# Altium schematic sheet Linear_Pos_regulator.SchDoc: FPGA Motherboard for Digital Multiplexed Readout, McGill U.
size A; DocumentNumber: DfMUX23; Revision: Rev0, Prototype; SheetNumber: 23; SheetTotal: 27; PageSetup: Record=PageOptions|CenterHorizontal=True|CenterVertical=True|PrintScale=1.05|XCorrection=1.00|YCorrection=1.00|PrintKind=0|BorderSize=5000000|LeftOffset=0|BottomOffset=0|Orientation=2|PaperLength=1000|PaperWidth=1000|Scale=100|PaperSource=7|PrintQuality=-4|MediaType=1|DitherType=10|PaperKind=Letter|PrintScaleMode=1
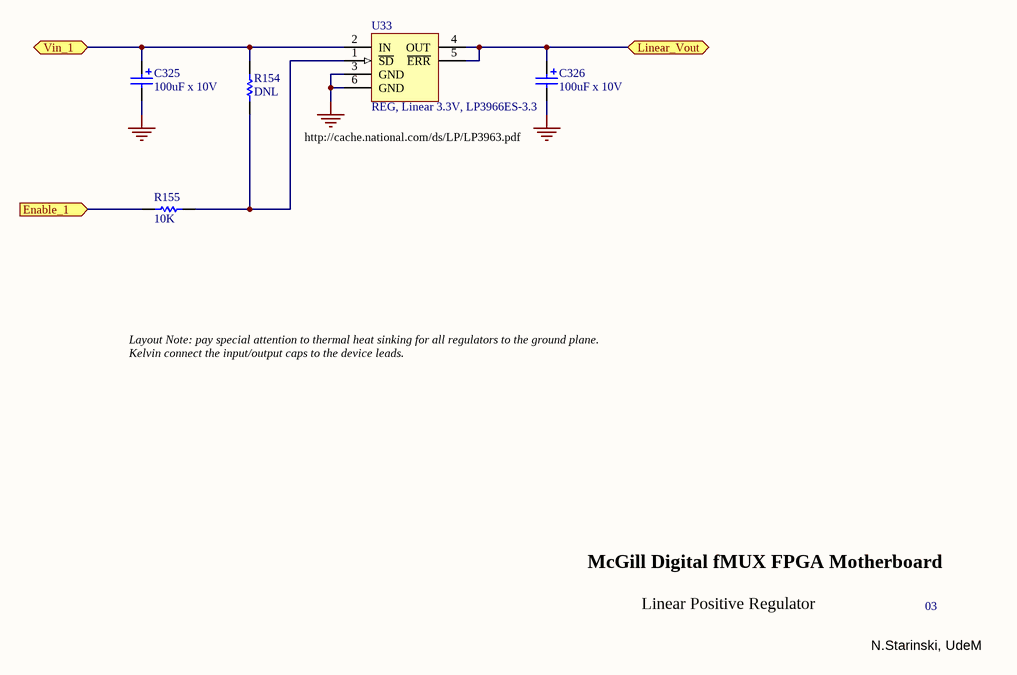
[diagram p0: Linear_Pos_regulator.SchDoc]

## Parts
C325  100uF x 10V  [TC6032-2412]
C326  100uF x 10V  [TC6032-2412]
R154  DNL  [CR1608-0603]
R155  10K  [CR1608-0603]
U33  REG, Linear 3.3V, LP3966ES-3.3  [TS5B]

## Ports
Enable_1 (in), Linear_Vout, Vin_1

## Nets
GND: C325.2 C326.2 U33.3(GND) U33.6(GND)
Enable_1: R155.1 ; port Enable_1
Linear_Vout: C326.1 U33.4(OUT) U33.5(~{ERR}) ; port Linear_Vout
Vin_1: C325.1 R154.2 U33.2(IN) ; port Vin_1
NetR154_1: R154.1 R155.2 U33.1(~{SD})

## Notes on the sheet
- http://cache.national.com/ds/LP/LP3963.pdf
- Layout Note: pay special attention to thermal heat sinking for all regulators to the ground plane. Kelvin connect the input/output caps to the device leads.
- McGill Digital fMUX FPGA Motherboard
- Linear Positive Regulator
- 03
- N.Starinski, UdeM

## Library data of the parts
C325 C326 = Cap Pol3: CAP TANTC TPSC107K010R0075; Published: 8-Jun-2000; LatestRevisionDate: 17-Jul-2002; LatestRevisionNote: Re-released for DXP Platform.; PackageReference: C0805; Publisher: Altium Limited
R154 = Res Semi: Semiconductor Resistor; Published: 8-Jun-2000; LatestRevisionDate: 17-Jul-2002; LatestRevisionNote: Re-released for DXP Platform.; Publisher: Altium Limited
R155 = Res Semi: Resistor 0603; Published: 8-Jun-2000; LatestRevisionDate: 17-Jul-2002; LatestRevisionNote: Re-released for DXP Platform.; Publisher: Altium Limited
U33 = LP3966: 3A Fast Ultra Low Dropout Linear Regulator